# Altium schematic sheet PWR_5to-12_MC34063.SchDoc
size A4
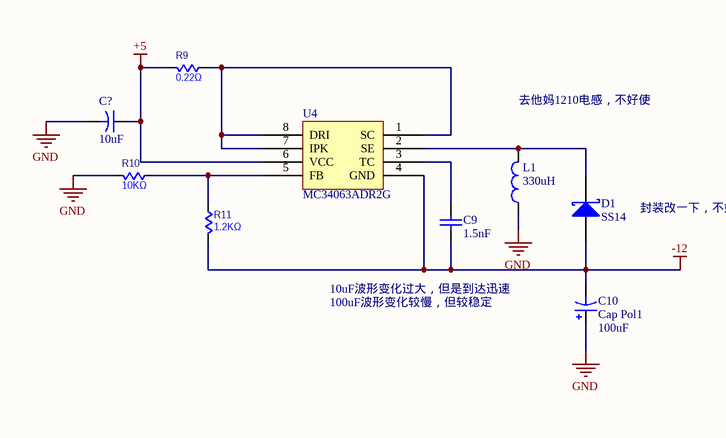
[diagram p0: PWR_5to-12_MC34063.SchDoc]

## Parts
C9  value 1.5nF  [0805]  (hidden comment: Cap)
C10  Cap Pol1  value 100uF  [Cap-47uF]
C?  value 10uF  [Cap-47uF]  (hidden comment: Cap Pol)
D1  Type: SS14  [DO-214  贴片二极管]  (hidden comment: D-Schottky)
L1  value 330uH  [1210]  (hidden comment: Inductor)
R9  value 0.22Ω  [0805]  (hidden comment: Res)
R10  value 10KΩ  [0805]  (hidden comment: Res)
R11  value 1.2KΩ  [0805]  (hidden comment: Res)
U4  MC34063ADR2G  [MC34063]

## Nets
+5: C?.1 R9.2 U4.6(VCC)
-12: C9.1 C10.2 D1.1(A) R11.2 U4.4(GND)
GND: C10.1 C?.2 L1.1 R10.2
NetC9_2: C9.2 U4.3(TC)
NetD1_2: D1.2(K) L1.2 U4.2(SE)
NetR9_1: R9.1 U4.1(SC) U4.7(IPK) U4.8(DRI)
NetR10_1: R10.1 R11.1 U4.5(FB)

## Notes on the sheet
- 去他妈1210电感，不好使
- 封装改一下，不好看
- 10uF波形变化过大，但是到达迅速
- 100uF波形变化较慢，但较稳定

## Library data of the parts
C9 = Cap: Capacitor; Published: 8-Jun-2000; LatestRevisionDate: 17-Jul-2002; LatestRevisionNote: Re-released for DXP Platform.; Publisher: Altium Limited
C10 = Cap Pol1: Polarized Capacitor (Radial); Published: 8-Jun-2000; LatestRevisionDate: 17-Jul-2002; LatestRevisionNote: Re-released for DXP Platform.; PackageReference: RB7.6-15; Publisher: Altium Limited; PackageDescription: Polarized Capacitor (Radial); 2 Leads
C? = Cap Pol: Capacitor; Published: 23-Sep-2002; PackageReference: CAPR5-4X5; Publisher: Altium Limited
D1 = D-Schottky: 肖特基二极管; Published: 8-Jun-2000; LatestRevisionDate: 17-Jul-2002; LatestRevisionNote: Re-released for DXP Platform.; PackageReference: SMB; Publisher: Altium Limited; Code_JEDEC: DO-214-AA
L1 = Inductor: 电感; Code_IEC: 1005; Published: 8-Jun-2000; LatestRevisionDate: 17-Jul-2002; LatestRevisionNote: Re-released for DXP Platform.; PackageReference: 0402-A; Publisher: Altium Limited; Code_JEITA: 0402
R9-R11 = Res: 常规电阻
U4 = MC34063: DC-DC Switching Buck, Boost, Inverting Regulator